# Altium schematic sheet 05 Cellular.SchDoc
size A3
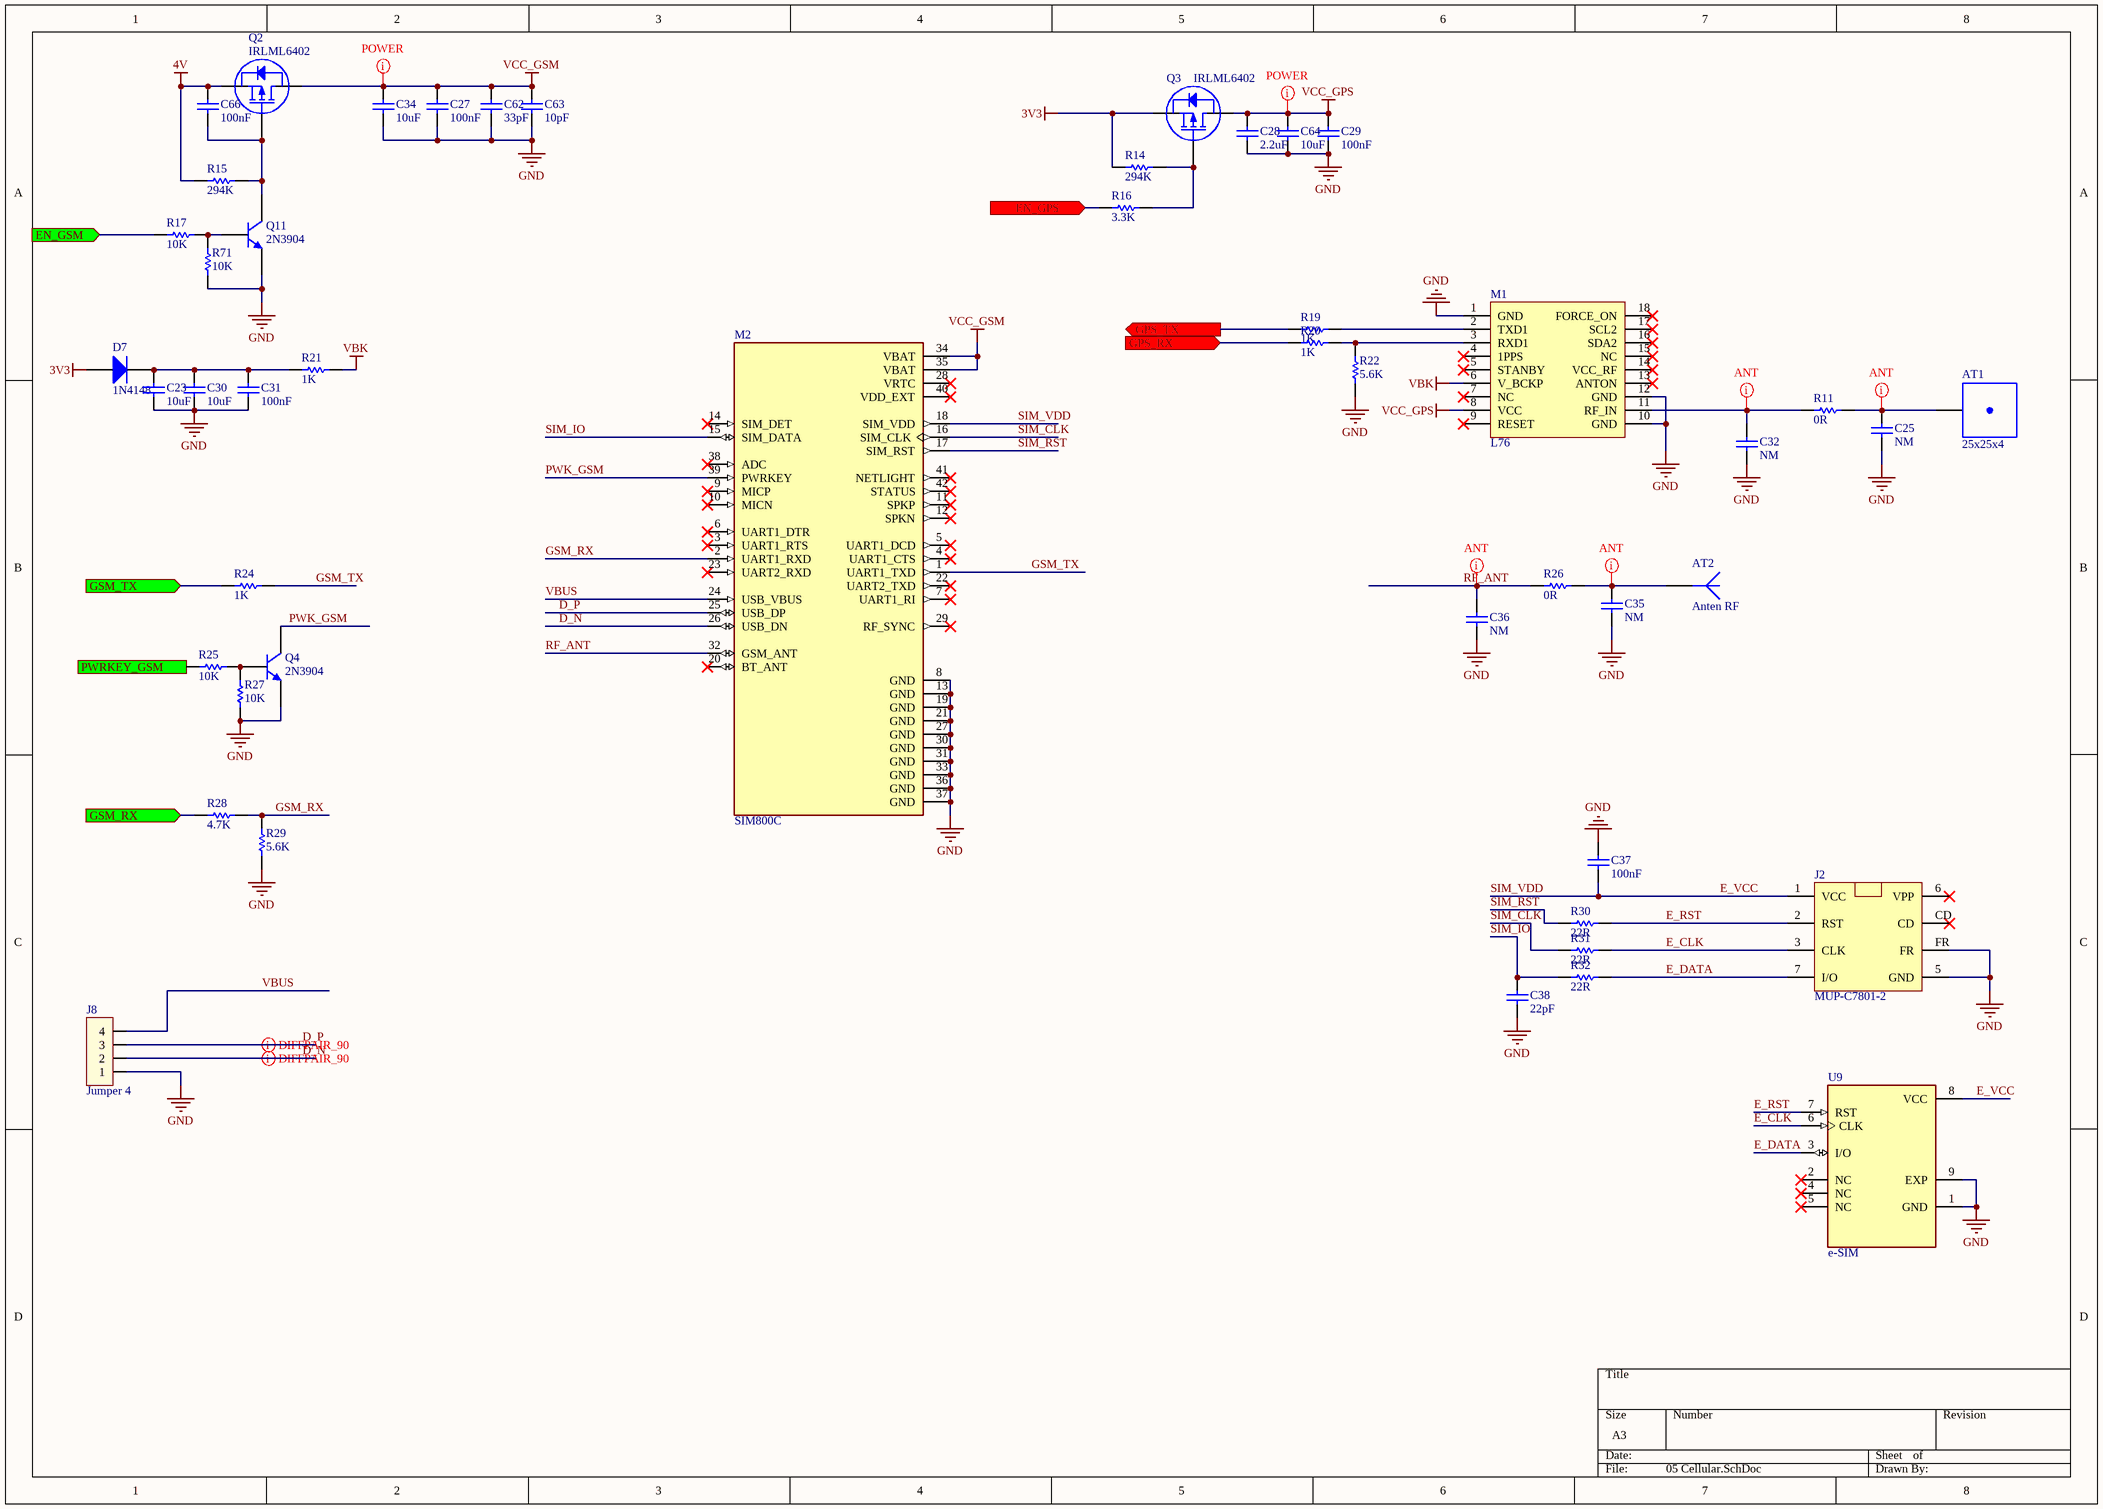
[diagram p0: 05 Cellular.SchDoc]

## Parts
AT1  25x25x4  [Jinchang - 1575]
AT2  Anten RF  [ANT_GSM]
C23  10uF  [0603 - C]
C25  NM  [0603 - C]
C27  100nF  [0603 - C]
C28  2.2uF  [0603 - C]
C29  100nF  [0603 - C]
C30  10uF  [0603 - C]
C31  100nF  [0603 - C]
C32  NM  [0603 - C]
C34  10uF  [0603 - C]
C35  NM  [0603 - C]
C36  NM  [0603 - C]
C37  100nF  [0603 - C]
C38  22pF  [0603 - C]
C62  33pF  [0603 - C]
C63  10pF  [0603 - C]
C64  value 10uF  [0603 - C]  (hidden comment: 1uF)
C66  100nF  [0603 - C]
D7  1N4148  [SOD-123]
J2  MUP-C7801-2  [MUP-C7801-2]
J8  Jumper 4  [JP4]
M1  L76  [Quectel L76]
M2  SIM800C  [SIM800C_1]
Q2  IRLML6402  [SOT23B]
Q3  IRLML6402  [SOT23B]
Q4  2N3904  [SOT23B]
Q11  2N3904  [SOT23B]
R11  0R  [0603 - R]
R14  294K  [0603 - R]
R15  294K  [0603 - R]
R16  3.3K  [0603 - R]
R17  10K  [0603 - R]
R19  1K  [0603 - R]
R20  1K  [0603 - R]
R21  1K  [0603 - R]
R22  5.6K  [0603 - R]
R24  1K  [0603 - R]
R25  10K  [0603 - R]
R26  0R  [0603 - R]
R27  10K  [0603 - R]
R28  4.7K  [0603 - R]
R29  5.6K  [0603 - R]
R30  22R  [0603 - R]
R31  22R  [0603 - R]
R32  22R  [0603 - R]
R71  10K  [0603 - R]
U9  e-SIM  [E-SIM 5*6mm]

## Ports
EN_GPS (in), EN_GSM (in), GPS_RX (in), GPS_TX (out), GSM_RX (in), GSM_TX (in), PWRKEY_GSM (in)

## Nets
3V3: D7.1(A) Q3.2(S) R14.1
4V: C66.2 Q2.2(S) R15.1
GND: C23.1 C25.1 C27.1 C28.1 C29.1 C30.1 C31.1 C32.1 C34.1 C35.1 C36.1 C37.2 C38.1 C62.1 C63.1 C64.1 J2.5(GND) J2.FR J8.1 M1.1(GND) M1.10(GND) M1.12(GND) M2.8(GND) M2.13(GND) M2.19(GND) M2.21(GND) M2.27(GND) M2.30(GND) M2.31(GND) M2.33(GND) M2.36(GND) M2.37(GND) Q4.2(E) Q11.2(E) R22.2 R27.1 R29.1 R71.2 U9.1(GND) U9.9(EXP)
VBK: M1.6(V_BCKP) R21.2
VCC_GPS: C28.2 C29.2 C64.2 M1.8(VCC) Q3.3(D)
VCC_GSM: C27.2 C34.2 C62.2 C63.2 M2.34(VBAT) M2.35(VBAT) Q2.3(D)
D_N: J8.2 M2.26(USB_DN)
D_P: J8.3 M2.25(USB_DP)
E_CLK: J2.3(CLK) R31.2 U9.6(CLK)
E_DATA: J2.7(I/O) R32.2 U9.3(I/O)
E_RST: J2.2(RST) R30.2 U9.7(RST)
E_VCC: C37.1 J2.1(VCC) M2.18(SIM_VDD) U9.8(VCC)  [also labelled SIM_VDD]
EN_GPS: R16.1 ; port EN_GPS
EN_GSM: R17.2 ; port EN_GSM
GPS_RX: R20.1 ; port GPS_RX
GPS_TX: R19.1 ; port GPS_TX
GSM_RX: M2.2(UART1_RXD) R28.2 R29.2
GSM_RX: R28.1 ; port GSM_RX  [a separate net that carries the same name]
GSM_TX: M2.1(UART1_TXD) R24.2
GSM_TX: R24.1 ; port GSM_TX  [a separate net that carries the same name]
PWK_GSM: M2.39(PWRKEY) Q4.3(C)
PWRKEY_GSM: R25.2 ; port PWRKEY_GSM
RF_ANT: C36.2 M2.32(GSM_ANT) R26.1
SIM_CLK: M2.16(SIM_CLK) R31.1
SIM_IO: C38.2 M2.15(SIM_DATA) R32.1
SIM_RST: M2.17(SIM_RST) R30.1
VBUS: J8.4 M2.24(USB_VBUS)
NetAT1_1: AT1.1(ANT) C25.2 R11.2
NetAT2_1: AT2.1(A) C35.2 R26.2
NetC23_2: C23.2 C30.2 C31.2 D7.2(K) R21.1
NetC32_2: C32.2 M1.11(RF_IN) R11.1
NetC66_1: C66.1 Q2.1(G) Q11.3(C) R15.2
NetM1_2: M1.2(TXD1) R19.2
NetM1_3: M1.3(RXD1) R20.2 R22.1
NetQ3_1: Q3.1(G) R14.2 R16.2
NetQ4_1: Q4.1(B) R25.1 R27.2
NetQ11_1: Q11.1(B) R17.1 R71.1

Not connected (* = marked no-connect by the designer): J2 6(VPP)* CD*; M1 4(1PPS)* 5(STANBY)* 7(NC)* 9(RESET)* 13(ANTON)* 14(VCC_RF)* 15(NC)* 16(SDA2)* 17(SCL2)* 18(FORCE_ON)*; M2 3(UART1_RTS)* 4(UART1_CTS)* 5(UART1_DCD)* 6(UART1_DTR)* 7(UART1_RI)* 9(MICP)* 10(MICN)* 11(SPKP)* 12(SPKN)* 14(SIM_DET)* 20(BT_ANT)* 22(UART2_TXD)* 23(UART2_RXD)* 28(VRTC)* 29(RF_SYNC)* 38(ADC)* 40(VDD_EXT)* 41(NETLIGHT)* 42(STATUS)*; U9 2(NC)* 4(NC)* 5(NC)*

## Layout directives
differential pair; differential pair class DIFF90: D_N, D_P
net class ANT: NetAT1_1, NetAT2_1, NetC32_2, RF_ANT
net class POWER: VCC_GPS, VCC_GSM

## Library data of the parts
AT1 = ANT-GPS 25x25: 25x25x4mm thick GPS Patch Antenna; MPN: JTDT1575-1602S; MFR: Jinchang & Amotech; Company ID: VT_ANT_GPS 1596; MPN2: A25-4102820-AMT23
AT2 = ANT_GSM_PCB: Antenna GSM PCB; MFR: VNET; MPN: PCB
C23 C30 C34 C64 = Cap 0603 10uF: CAP CER 10UF 16V X5R 0603; MPN: EMK107BBJ106MA-T; MFR: Yageo; Company ID: VT_CAP_C0603 10uF; Size: C0603: 10uF; Package: 0603
  C23 C30 C34: Value: 10uF
C25 C32 C35 C36 = Cap 0603 NM: CAP CER xxPF 0603; MFR: Yageo; Company ID: VT_CAP_C0603 NM; MPN: NM; Size: C0603: NM; Value: NM
C27 C29 C31 C37 C66 = Cap 0603 100nF: CAP CER 100nF 50V C0G/NP0 0603 ±5%; MPN: CL10C104JB8NNNC; MFR: SAMSUNG; Company ID: VT_CAP_C0603 100nF; Voltage: 50V; Package: 0603; Value: 100nF; Size: C0603: 100nF
C28 = Cap 0603 2.2uF: CAP CER 2.2UF 16V X7R 0603; MPN: CL10A225KQ8NNNC; MFR: SAMSUNG; Company ID: VT_CAP_C0603 2.2uF; Size: C0603: 2.2uF; Value: 2.2uF
C38 = Cap 0603 22pF: CAP CER 22PF 50V C0G/NP0 0603; MPN: CL10C220JB8NNNC; MFR: SAMSUNG; Company ID: VT_CAP_C0603 22pF; Value: 22pF; Size: C0603: 22pF
C62 = Cap 0603 33pF: CAP CER 33PF 50V C0G 0603; MFR: Yageo; MPN: AC0603FRNPO9BN330; Company ID: VT_CAP_C0603 33pF; Size: C0603: 33pF; Value: 33pF
C63 = Cap 0603 10pF: CAP CER 10PF 50V C0G/NP0 0603; MPN: CL10C100JB8NNNC; MFR: SAMSUNG; Company ID: VT_CAP_C0603 10pF; Size: C0603: 10pF; Value: 10pF
D7 = Diode 1N4148: DIODE GEN PURP 100V 300MA SOD123; MPN: 1N4148W-7-F; MFR: DIODES; Company ID: VT_DIODE_1N4148W-7-F
J2 = Socket Nano SIM MUP-C7801-2: Socket Nano Sim 7pin (6+1); MFR: MUP; Company ID: VT_CONN_SIM MUP-C7801-2; MPN: MUP-C7801-2
J8 = JP4: Jumper 4, 2.54mmx4
M1 = Quectel L76: L76 series, the smallest GNSS modules; MPN: L76-LB; Company ID: VT_Module_GPS L76-LB; MFR: Quectel
M2 = SIM800C_1: SIM800C is a complete Quad-band GSM/GPRS solution in a SMT type; MFR: SIMCOM; Company ID: VT_Module_GSM SIM800C; MPN: SIM800C
Q2 Q3 = MOSFET IRLML6402TRPBF: MOSFET P-CH 30V 3.6A SOT-23-3; MFR: Infineon Technologies; Company ID: VT_MOSFET_IRLML6402TRPBF; MPN: IRLML6402TRPBF
Q4 Q11 = Transistor 2N3904: TRANS NPN 40V 0.2A SOT-23; MPN: MMBT3904; MFR: Fairchild; Company ID: VT_TRANSISTOR_3904
R11 R26 = Res 0603 0R: RES SMD 0 OHM JUMPER 1/10W 0603; MFR: Yageo; MPN: RC0603FR-070RL; Company ID: VT_RES_R0603 0R; Size: R0603: 0R; Value: 0R
R14 R15 = Res 0603 294K: RES SMD 294K OHM 1% 1/10W 0603; MFR: Yageo; MPN: RC0603FR-07294KL; Company ID: VT_ĐIỆN TRỞ_R0603 294K; Value: 294K
R16 = Res 0603 3.3K: RES SMD 3.3K OHM 1% 1/10W 0603; MFR: Yageo; MPN: RC0603FR-073K3L; Company ID: VT_RES_R0603 3.3K; Value: 3.3K; Size: R0603: 3.3K
R17 R25 R27 R71 = Res 0603 10K: RES SMD 10K OHM 1% 1/10W 0603; MFR: Yageo; MPN: RC0603FR-0710KL; Company ID: VT_RES_R0603 10K; Value: 10K; Size: R0603: 10K
R19-R21 R24 = Res 0603 1K: RES SMD 1K OHM 1% 1/10W 0603; MFR: Yageo; MPN: RC0603FR-071KL; Company ID: VT_RES_R0603 1K; Value: 1K; Size: R0603: 1K
R22 R29 = Res 0603 5.6K: RES SMD 5.6K OHM 1% 1/10W 0603; MFR: Yageo; MPN: RC0603FR-075K6L; Company ID: VT_RES_R0603 5.6K; Value: 5.6K; Size: R0603: 5.6K
R28 = Res 0603 4.7K: RES SMD 4.7K OHM 1% 1/10W 0603; MFR: Yageo; MPN: RC0603FR-074K7L; Company ID: VT_RES_R0603 4.7K; Size: R0603: 4.7K; Value: 4.7K
R30-R32 = Res 0603 22R: RES SMD 22 OHM 1% 1/10W 0603; MFR: Yageo; MPN: RC0603FR-0722RL; Company ID: VT_RES_R0603 22R; Value: 22R; Size: R0603: 22R
U9 = SIM-E-MFF2-GL-250: SIM Cards eUICC MFF2 Global SIM; MFR: HoloGram; Solder: SMT; MPN: SIM-E-MFF2-GL-250; Value: e-SIM; Category: IC; PinCount: 8